# Altium project Electronics.PrjPcb
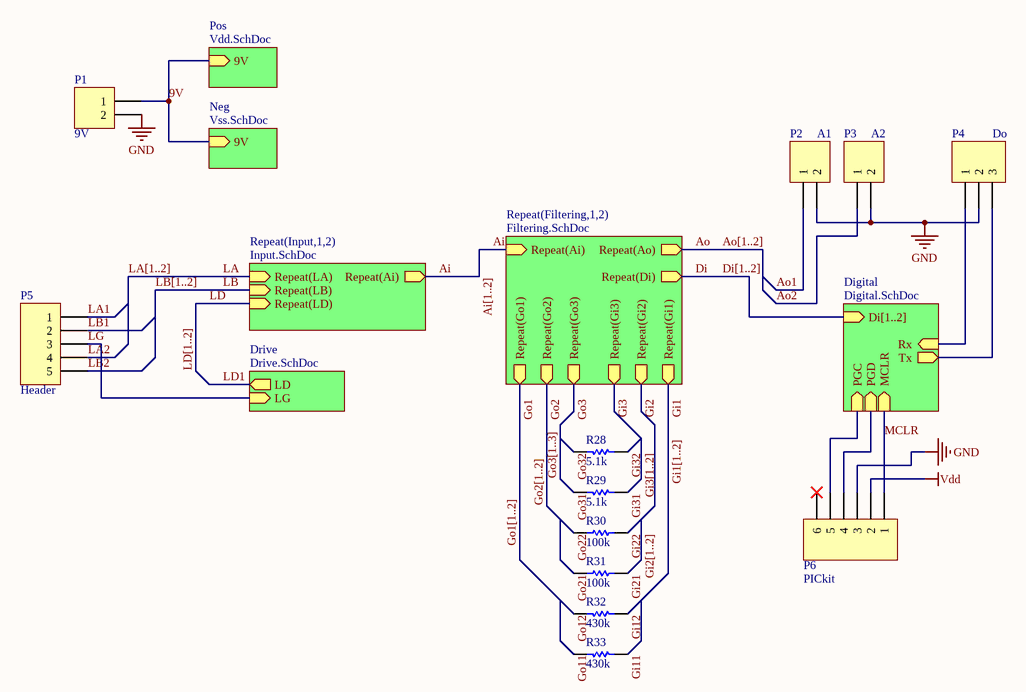
[diagram p0: Main.SchDoc]
7 sheets, 114 parts. Net scope: hierarchical (ports join the sheet entries above them; power ports are global).
Board file: Main.PcbDoc
Sheets:
  Main.SchDoc
    Filtering1 = Filtering.SchDoc
    Filtering2 = Filtering.SchDoc
    Digital = Digital.SchDoc
    Input1 = Input.SchDoc
    Input2 = Input.SchDoc
    Drive = Drive.SchDoc
    Pos = Vdd.SchDoc
    Neg = Vss.SchDoc

## Sheet Main.SchDoc: Myon Deco - Subgroup Connections
size A; DrawnBy: Matias Lopez; Revision: Prototype; SheetNumber: 1; SheetTotal: 7

### Parts
P1  9V  [HDR1X2]
P2  A1  [HDR1X2]
P3  A2  [HDR1X2]
P4  Do  [HDR1X3]
P5  Header  [HDR1X5]
P6  PICkit  [HDR1X6]
R28  value 5.1k  [AXIAL-0.3]  (hidden comment: R26)
R29  value 5.1k  [AXIAL-0.3]  (hidden comment: R26)
R30  value 100k  [AXIAL-0.3]  (hidden comment: R17)
R31  value 100k  [AXIAL-0.3]  (hidden comment: R17)
R32  value 430k  [AXIAL-0.3]  (hidden comment: R14)
R33  value 430k  [AXIAL-0.3]  (hidden comment: R14)

### Sub-sheets
Digital = Digital.SchDoc: Di[1..2] (in), Rx (in), PGC (in), PGD (in), MCLR (in), Tx (out)
Drive = Drive.SchDoc: LG (in), LD (out)
Neg = Vss.SchDoc: 9V (in)
Pos = Vdd.SchDoc: 9V (in)
Repeat(Filtering,1,2) = Filtering.SchDoc: Repeat(Ai) (in), Repeat(Ao) (out), Repeat(Di) (out), Repeat(Gi1) (out), Repeat(Go1) (out), Repeat(Gi3) (out), Repeat(Go3) (out), Repeat(Go2) (out), Repeat(Gi2) (out)
Repeat(Input,1,2) = Input.SchDoc: Repeat(Ai) (out), Repeat(LA) (in), Repeat(LB) (in), Repeat(LD) (in)

### Nets
GND: P1.2 P2.2 P3.2 P4.2 P6.3
Vdd: P6.2
9V: P1.1 ; sheet Pos/9V, sheet Neg/9V
Ai: sheet Repeat(Filtering,1,2)/Repeat(Ai), sheet Repeat(Input,1,2)/Repeat(Ai)
Ao: sheet Repeat(Filtering,1,2)/Repeat(Ao)
Ao1: P2.1 R31.1  [also labelled Gi21]
Ao2: P3.1 R30.1  [also labelled Gi22]
Di: sheet Repeat(Filtering,1,2)/Repeat(Di)
Di1: R29.1  [also labelled Gi31]
Di2: R28.1  [also labelled Gi32]
Gi1: sheet Repeat(Filtering,1,2)/Repeat(Gi1)
Gi2: sheet Repeat(Filtering,1,2)/Repeat(Gi2)
Gi3: sheet Repeat(Filtering,1,2)/Repeat(Gi3)
Gi11: R33.2  [project net GHPF]
Gi12: R32.2  [project net GHPF]
Go1: sheet Repeat(Filtering,1,2)/Repeat(Go1)
Go2: sheet Repeat(Filtering,1,2)/Repeat(Go2)
Go3: sheet Repeat(Filtering,1,2)/Repeat(Go3)
Go11: R33.1
Go12: R32.1
Go21: R31.2
Go22: R30.2
Go31: R29.2
Go32: R28.2
LA: sheet Repeat(Input,1,2)/Repeat(LA)
LA1: P5.1
LA2: P5.4
LB: sheet Repeat(Input,1,2)/Repeat(LB)
LB1: P5.2
LB2: P5.5
LD: sheet Repeat(Input,1,2)/Repeat(LD)
LG: P5.3 ; sheet Drive/LG
MCLR: P6.1 ; sheet Digital/MCLR
NetP4_1: P4.1 ; sheet Digital/Rx
NetP4_3: P4.3 ; sheet Digital/Tx
NetP6_4: P6.4 ; sheet Digital/PGD
NetP6_5: P6.5 ; sheet Digital/PGC

Not connected (* = marked no-connect by the designer): P6 6*

### Buses and harness runs
bus Ai[1..2]
bus Ao[1..2]
bus Di[1..2] = sheet Digital/Di[1..2]
bus Gi1[1..2]
bus Gi2[1..2]
bus Gi3[1..2]
bus Go1[1..2]
bus Go2[1..2]
bus Go3[1..3]
bus LA[1..2]
bus LB[1..2]
bus LD[1..2]

### Library data of the parts
P1-P3 = Header 2: Header, 2-Pin; LatestRevisionDate: 17-Jul-2002; LatestRevisionNote: Re-released for DXP Platform.; Publisher: Altium Limited
P4 = Header 3: Header, 3-Pin; LatestRevisionDate: 17-Jul-2002; LatestRevisionNote: Re-released for DXP Platform.; Publisher: Altium Limited
P5 = Header 5: Header, 5-Pin; LatestRevisionDate: 17-Jul-2002; LatestRevisionNote: Re-released for DXP Platform.; Publisher: Altium Limited
P6 = Header 6: Header, 6-Pin; LatestRevisionDate: 17-Jul-2002; LatestRevisionNote: Re-released for DXP Platform.; Publisher: Altium Limited
R28-R33 = Res1: Resistor; Published: 8-Jun-2000; LatestRevisionDate: 17-Jul-2002; LatestRevisionNote: Re-released for DXP Platform.; PackageReference: AXIAL-0.3; Publisher: Altium Limited; PackageDescription: Axial Device, Thru-Hole; 2 Leads; 0.3 in Pin Spacing

## Sheet Filtering.SchDoc: Myon Deco - Filtering Stages
size A; DrawnBy: Matias Lopez; Revision: Prototype; SheetNumber: 5; SheetTotal: 6
Used 2 times, as channels Filtering1, Filtering2. Parts and nets are listed once, with the designators drawn on the sheet.
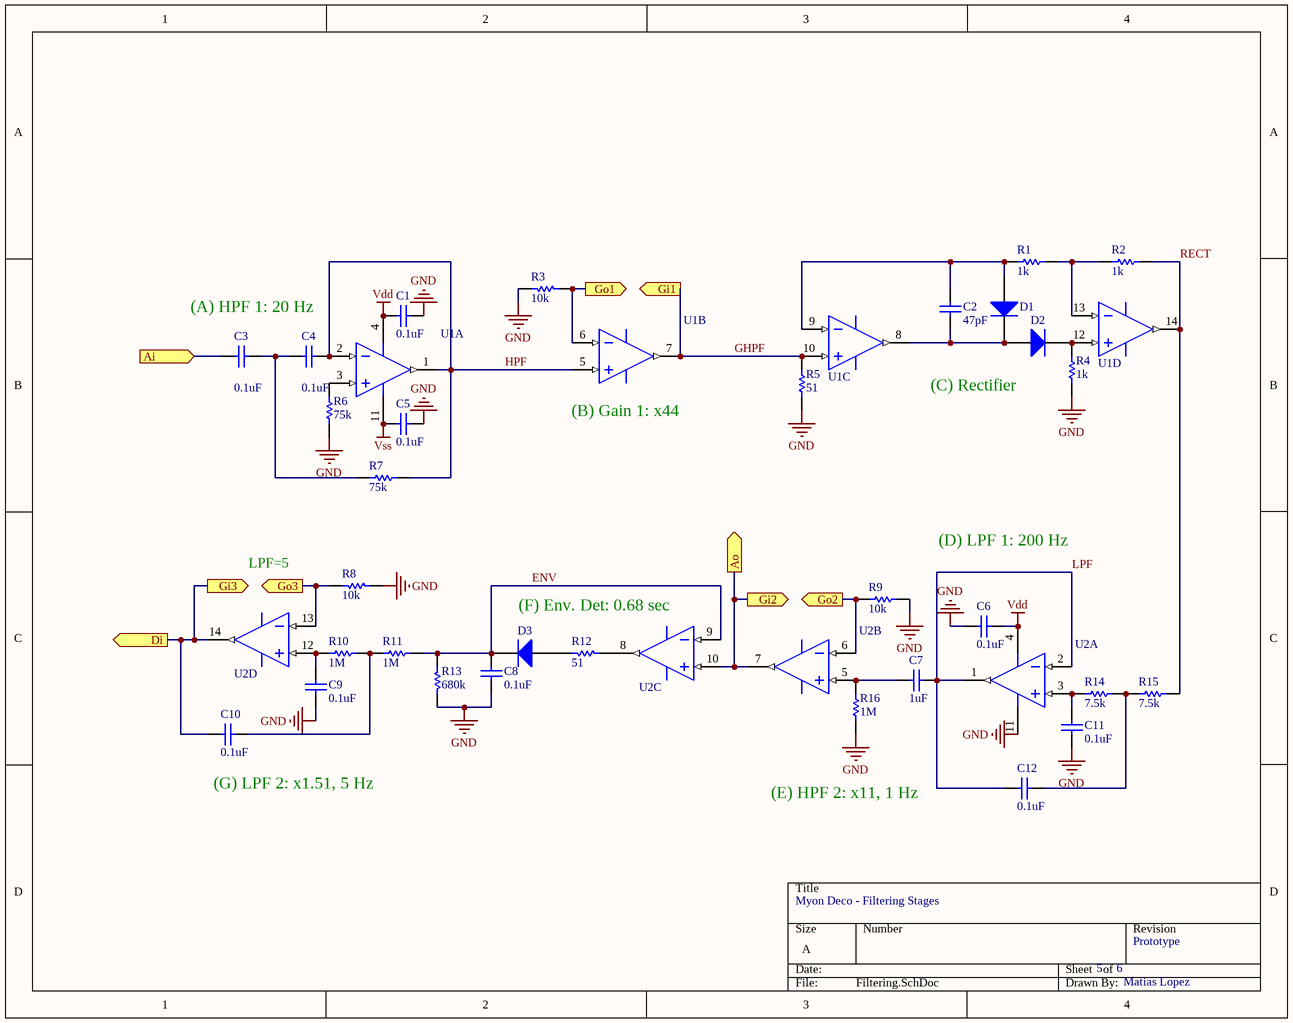
[diagram p1: Filtering.SchDoc]

### Parts
C1  value 0.1uF  [C0805]  (hidden comment: Cap)
C2  value 47pF  [C0805]  (hidden comment: C20)
C3  value 0.1uF  [C0805]  (hidden comment: C15)
C4  value 0.1uF  [C0805]  (hidden comment: C16)
C5  value 0.1uF  [C0805]  (hidden comment: Cap)
C6  value 0.1uF  [C0805]  (hidden comment: Cap)
C7  value 1uF  [C0805]  (hidden comment: C19)
C8  value 0.1uF  [C0805]  (hidden comment: C23)
C9  value 0.1uF  [C0805]  (hidden comment: C21)
C10  value 0.1uF  [C0805]  (hidden comment: C22)
C11  value 0.1uF  [C0805]  (hidden comment: C21)
C12  value 0.1uF  [C0805]  (hidden comment: C22)
D1  D2  [425]  (value not drawn)
D2  D3  [425]  (value not drawn)
D3  D4  [425]  (value not drawn)
R1  value 1k  [C1206]  (hidden comment: R20)
R2  value 1k  [C1206]  (hidden comment: R19)
R3  value 10k  [C1206]  (hidden comment: R13)
R4  value 1k  [C1206]  (hidden comment: R24)
R5  value 51  [C1206]  (hidden comment: R25)
R6  value 75k  [C1206]  (hidden comment: R15)
R7  value 75k  [C1206]  (hidden comment: R16)
R8  value 10k  [C1206]  (hidden comment: R26)
R9  value 10k  [C1206]  (hidden comment: R18)
R10  value 1M  [C1206]  (hidden comment: R21)
R11  value 1M  [C1206]  (hidden comment: R22)
R12  value 51  [C1206]  (hidden comment: R26)
R13  value 680k  [C1206]  (hidden comment: R27)
R14  value 7.5k  [C1206]  (hidden comment: R21)
R15  value 7.5k  [C1206]  (hidden comment: R22)
R16  value 1M  [C1206]  (hidden comment: R23)
U1  U7  [TI-D14_N]  (value not drawn)  (parts A,B,C,D of 4)
U2  U8  [TI-D14_N]  (value not drawn)  (parts A,B,C,D of 4)

### Ports
Ai (in), Ao (out), Di (out), Gi1 (out), Gi2 (out), Gi3 (out), Go1 (out), Go2 (out), Go3 (out)

### Nets
GND: C1.2 C5.2 C6.1 C8.1 C9.1 C11.1 R3.1 R4.1 R5.1 R6.1 R8.1 R9.1 R13.1 R16.2 U2.11(V-)
Vdd: C1.1 C6.2 U1.4(V+) U2.4(V+)
Vss: C5.1 U1.11(V-)
Ai: C3.1 ; port Ai
Ao: U2.7(OUT_B) U2.10(IN_C+) ; port Ao, port Gi2
Di: C10.1 U2.14(OUT_D) ; port Di, port Gi3
ENV: C8.2 D3.2(K) R11.1 R13.2 U2.9(IN_C-)
GHPF: R5.2 U1.7(OUT_B) U1.10(IN_C+) ; port Gi1
Go1: R3.2 U1.6(IN_B-) ; port Go1
Go2: R9.2 U2.6(IN_B-) ; port Go2
Go3: R8.2 U2.13(IN_D-) ; port Go3
HPF: C4.2 R7.1 U1.1(OUT_A) U1.2(IN_A-) U1.5(IN_B+)
LPF: C7.2 C12.1 U2.1(OUT_A) U2.2(IN_A-)
RECT: R2.1 R15.1 U1.14(OUT_D)
NetC2_1: C2.1 D1.1(A) R1.2 U1.9(IN_C-)
NetC2_2: C2.2 D1.2(K) D2.1(A) U1.8(OUT_C)
NetC3_2: C3.2 C4.1 R7.2
NetC7_1: C7.1 R16.1 U2.5(IN_B+)
NetC9_2: C9.2 R10.2 U2.12(IN_D+)
NetC10_2: C10.2 R10.1 R11.2
NetC11_2: C11.2 R14.2 U2.3(IN_A+)
NetC12_2: C12.2 R14.1 R15.2
NetD2_2: D2.2(K) R4.2 U1.12(IN_D+)
NetD3_1: D3.1(A) R12.1
NetR1_1: R1.1 R2.2 U1.13(IN_D-)
NetR6_2: R6.2 U1.3(IN_A+)
NetR12_2: R12.2 U2.8(OUT_C)

### Channels
Filtering1: designators end in _Filtering1; ports Ai=Ai1 Ao=Ao1 Di=Di1 Gi1=GHPF Gi2=Ao1 Gi3=Di1 Go1=Go11 Go2=Go21 Go3=Go31
Filtering2: designators end in _Filtering2; ports Ai=Ai2 Ao=Ao2 Di=Di2 Gi1=GHPF Gi2=Ao2 Gi3=Di2 Go1=Go12 Go2=Go22 Go3=Go32

### Notes on the sheet
- (A) HPF 1: 20 Hz
- (near U1) (B) Gain 1: x44
- (C) Rectifier
- LPF=5
- (D) LPF 1: 200 Hz
- (F) Env. Det: 0.68 sec
- (near C10) (G) LPF 2: x1.51, 5 Hz
- (E) HPF 2: x11, 1 Hz

### Library data of the parts
C1-C12 = Cap: Capacitor; Published: 8-Jun-2000; LatestRevisionDate: 17-Jul-2002; LatestRevisionNote: Re-released for DXP Platform.; PackageReference: RAD-0.3; Publisher: Altium Limited; PackageDescription: Radial Cap, Thru-Hole; 2 Leads; 0.3 in Pin Spacing
D1-D3 = Diode 1N4148: High Conductance Fast Diode; Published: 8-Jun-2000; LatestRevisionDate: 17-Jul-2002; LatestRevisionNote: Re-released for DXP Platform.; DatasheetVersion: 1997; PackageReference: DO-35; Publisher: Altium Limited; PackageDescription: Diode, Axial; Body 3.8 x 1.9 mm (LxDia. max), Lead Dia. 0.53 mm (max); Code_JEDEC: DO-204-AH; ComponentLink1Description: Manufacturer Link; ComponentLink1URL: http://www.fairchildsemi.com/; ComponentLink2Description: Datasheet; ComponentLink2URL: http://www.fairchildsemi.com/ds/1N%2F1N4148.pdf
R1-R16 = Res1: Resistor; Published: 8-Jun-2000; LatestRevisionDate: 17-Jul-2002; LatestRevisionNote: Re-released for DXP Platform.; PackageReference: AXIAL-0.3; Publisher: Altium Limited; PackageDescription: Axial Device, Thru-Hole; 2 Leads; 0.3 in Pin Spacing
U1 U2 = OPA4180IDR: 0.1 uV/C Drift, Quad, Low Noise, Rail-to-Rail, Zero Drift Operational Amplifier, 4 to 36 V, -40 to 105 degC, 14-pin SOIC (D14), Green (RoHS & no Sb/Br); Manufacturer: Texas Instruments; CMRR(Min)(dB): 104; GBW(Typ)(MHz): 2; IIB(Max)(pA): 1700; Iq per channel(Max)(mA): 0.525; Number of Channels: 4; Offset Drift(Typ)(uV/C): 0.1; Rating: Catalog; Slew Rate(Typ)(V/us): 0.8; Sub Family: Precision Amplifier; Total Supply Voltage(Max)(+5V is 5, +/-5V is 10): 36; Vio (25C)(Max)(mV): 0.075; DatasheetVersion: SBOS584C; PackageVersion: 4040047-5/M, 06/2011; PackageReference: D14; PackageDescription: 14-Pin Plastic Small Outline, Body 8.65 x 3.9 mm, Pitch 1.27 mm; Eco-Plan: Green (RoHS & no Sb/Br); Total Supply Voltage(Min)(+5V is 5, +/-5V is 10): 4; Mounting Technology: Surface Mount; Code_JEDEC: MS-012; PartNumber: OPA4180IDR; ComponentLink1Description: Manufacturer URL; ComponentLink1URL: http://www.ti.com/; ComponentLink2Description: Datasheet; ComponentLink2URL: http://www.ti.com/lit/ds/symlink/opa4180.pdf; ComponentLink3Description: Package Specification; ComponentLink3URL: http://www.ti.com/lit/ml/mpds177g/mpds177g.pdf

## Sheet Digital.SchDoc: Myon Deco - Digital Stage
size A; DrawnBy: Matias Lopez; Revision: Prototype; SheetNumber: 4; SheetTotal: 7
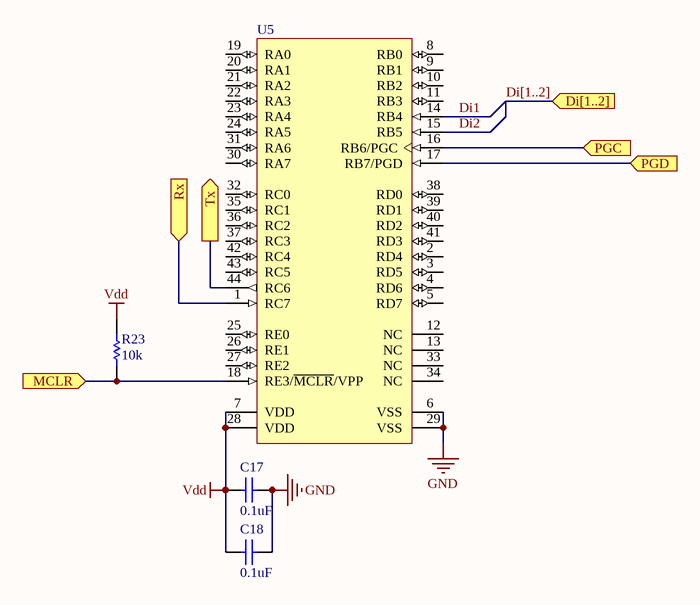
[diagram p2: Digital.SchDoc]

### Parts
C17  value 0.1uF  [C0805]  (hidden comment: Cap)
C18  value 0.1uF  [C0805]  (hidden comment: Cap)
R23  value 10k  [C1206]  (hidden comment: Res1)
U5  MYON  [MCHP-TQFP-PT44_N]  (value not drawn)

### Ports
Di[1..2] (in), MCLR (in), PGC (in), PGD (in), Rx (in), Tx (out)

### Nets
GND: C17.1 C18.1 U5.6(VSS) U5.29(VSS)
Vdd: C17.2 C18.2 R23.1 U5.7(VDD) U5.28(VDD)
Di1: U5.14(RB4)
Di2: U5.15(RB5)
MCLR: R23.2 U5.18(RE3/~{MCLR}/VPP) ; port MCLR
NetP4_1: U5.1(RC7) ; port Rx
NetP4_3: U5.44(RC6) ; port Tx
NetP6_4: U5.17(RB7/PGD) ; port PGD
NetP6_5: U5.16(RB6/PGC) ; port PGC

Not connected (* = marked no-connect by the designer): U5 2(RD4) 3(RD5) 4(RD6) 5(RD7) 8(RB0) 9(RB1) 10(RB2) 11(RB3) 12(NC) 13(NC) 19(RA0) 20(RA1) 21(RA2) 22(RA3) 23(RA4) 24(RA5) 25(RE0) 26(RE1) 27(RE2) 30(RA7) 31(RA6) 32(RC0) 33(NC) 34(NC) 35(RC1) 36(RC2) 37(RC3) 38(RD0) 39(RD1) 40(RD2) 41(RD3) 42(RC4) 43(RC5)

### Buses and harness runs
bus Di[1..2] = port Di[1..2]

### Library data of the parts
C17 C18 = Cap: Capacitor; Published: 8-Jun-2000; LatestRevisionDate: 17-Jul-2002; LatestRevisionNote: Re-released for DXP Platform.; PackageReference: RAD-0.3; Publisher: Altium Limited; PackageDescription: Radial Cap, Thru-Hole; 2 Leads; 0.3 in Pin Spacing
R23 = Res1: Resistor; Published: 8-Jun-2000; LatestRevisionDate: 17-Jul-2002; LatestRevisionNote: Re-released for DXP Platform.; PackageReference: AXIAL-0.3; Publisher: Altium Limited; PackageDescription: Axial Device, Thru-Hole; 2 Leads; 0.3 in Pin Spacing
U5 = PIC18F46K22-I/PT: Low-Power, High-Performance Microcontroller with XLP Technology, 64 MHz, 35 I/O, -40 to 85 degC, 44-pin TQFP (PT44), Tray; Manufacturer: Microchip; # of A/D Channels: 28; Digital Communication: 2 -A/E/USART, 2 -MSSP(SPI/I2C); EEPROM Data Memory (bytes): 1024; I/O Pins: 35; Internal Oscillator: 16 MHz, 31 kHz; Max. CPU Speed MHz: 64; Memory Type: Flash; Operation Voltage Range: 2.3V - 5.5V; Program Memory KWords: 32; RAM: 3896; Timers: 3 - 8-bit, 4 - 16-bit; DatasheetVersion: Rev. F; PackageVersion: C04-076B, 12/2012; PackageReference: TQFP-PT44; PackageDescription: 44-Lead Plastic Thin Quad Flatpack, 10 x 10 mm Body, 0.8 mm Pitch; Supplier 1: Digi-Key; Supplier Part Number 1: PIC18F46K22-I/PT-ND; Supplier 2: Farnell; Supplier Part Number 2: 1814980; Supplier 3: Farnell; Supplier Part Number 3: 1814980MPKG; Supplier 4: Newark; Supplier Part Number 4: 65R6013; Supplier 5: Mouser; Supplier Part Number 5: 579-PIC18F46K22IPT; Packing: TRAY; Program Memory KBytes: 64; RoHS: TRUE; Mounting Technology: Surface Mount; PartNumber: PIC18F46K22-I/PT; ComponentLink1Description: Datasheet; ComponentLink1URL: http://ww1.microchip.com/downloads/en/DeviceDoc/41412F.pdf; ComponentLink2Description: Package Specification; ComponentLink2URL: http://www.microchip.com/stellent/groups/techpub_sg/documents/packagingspec/en012702.pdf; ComponentLink3Description: URL Link1; ComponentLink3URL: Product URL:http://www.microchip.com/datasheet/PIC18F46K22

## Sheet Input.SchDoc: Myon Deco - Input Stage
size A; DrawnBy: Matias Lopez; Revision: Prototype; SheetNumber: 2; SheetTotal: 7
Used 2 times, as channels Input1, Input2. Parts and nets are listed once, with the designators drawn on the sheet.
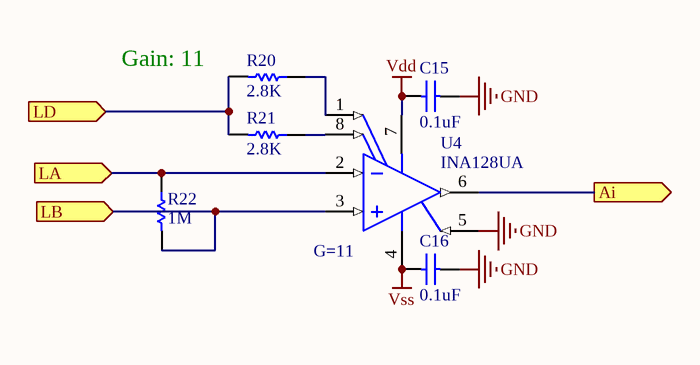
[diagram p3: Input.SchDoc]

### Parts
C15  value 0.1uF  [C0805]  (hidden comment: Cap)
C16  value 0.1uF  [C0805]  (hidden comment: Cap)
R20  value 2.8K  [C1206]  (hidden comment: Res1)
R21  value 2.8K  [C1206]  (hidden comment: Res1)
R22  value 1M  [C1206]  (hidden comment: Res1)
U4  INA128UA  [TI-D8_N]

### Ports
Ai (out), LA (in), LB (in), LD (in)

### Nets
GND: C15.1 C16.1 U4.5(REF)
Vdd: C15.2 U4.7(V+)
Vss: C16.2 U4.4(V-)
Ai: U4.6(VO) ; port Ai
LA: R22.1 U4.2(VIN-) ; port LA
LB: R22.2 U4.3(VIN+) ; port LB
LD: R20.2 R21.2 ; port LD
NetR20_1: R20.1 U4.1(RG)
NetR21_1: R21.1 U4.8(RG)

### Channels
Input1: designators end in _Input1; ports Ai=Ai1 LA=LA1 LB=LB1 LD=LD1
Input2: designators end in _Input2; ports Ai=Ai2 LA=LA2 LB=LB2 LD=LD2

### Notes on the sheet
- (near R20) Gain: 11
- (near U4) G=11

### Library data of the parts
C15 C16 = Cap: Capacitor; Published: 8-Jun-2000; LatestRevisionDate: 17-Jul-2002; LatestRevisionNote: Re-released for DXP Platform.; PackageReference: RAD-0.3; Publisher: Altium Limited; PackageDescription: Radial Cap, Thru-Hole; 2 Leads; 0.3 in Pin Spacing
R20-R22 = Res1: Resistor; Published: 8-Jun-2000; LatestRevisionDate: 17-Jul-2002; LatestRevisionNote: Re-released for DXP Platform.; PackageReference: AXIAL-0.3; Publisher: Altium Limited; PackageDescription: Axial Device, Thru-Hole; 2 Leads; 0.3 in Pin Spacing
U4 = INA128UA: Precision, Low Power Instrumentation Amplifier, -40 to 85 degC, 8-pin SOIC (D8), Green (RoHS & no Sb/Br); Manufacturer: Texas Instruments; CMRR(Min)(dB): 110; Gain(V/V): 1 to 10000; Input Bias Current (+/-)(Max)(nA): 10; Input Offset (+/-)(Max)(uV): 125; Input Offset Drift (+/-)(Max)(uV/Degrees Celsius): 1; Noise at 1kHz(Typ)(nV/rt(Hz)): 8; Non-Linearity (+/-)(Max)(%): 0.004; Quiescent Current (+/-)(Typ)(mA): 0.7; SubFamily: Dual Supply; Vs(Max)(V): 36; Vs(Min)(V): 4.5; DatasheetVersion: SBOS051B; PackageVersion: 4040047-3/M, 06/2011; PackageReference: D8; PackageDescription: 8-Pin Plastic Small Outline, Body 4.9 x 3.9 mm, Pitch 1.27 mm; Supplier 1: Digi-Key; Supplier Part Number 1: INA128UA-ND; Supplier 2: Newark; Supplier Part Number 2: 35C1730; Supplier 3: Mouser; Supplier Part Number 3: 595-INA128UA; Eco-Plan: Green (RoHS & no Sb/Br); Number of Channels: 1; Mounting Technology: Surface Mount; Code_JEDEC: MS-012; PartNumber: INA128UA; ComponentLink1Description: Manufacturer URL; ComponentLink1URL: http://www.ti.com/; ComponentLink2Description: Datasheet; ComponentLink2URL: http://www.ti.com/general/docs/lit/getliterature.tsp?genericPartNumber=INA128&fileType=pdf; ComponentLink3Description: Package Specification; ComponentLink3URL: http://www.ti.com/litv/pdf/msoi002j

## Sheet Drive.SchDoc: Myon Deco - Leg Drive
size A; DrawnBy: Matias Lopez; Revision: Prototype; SheetNumber: 3; SheetTotal: 7
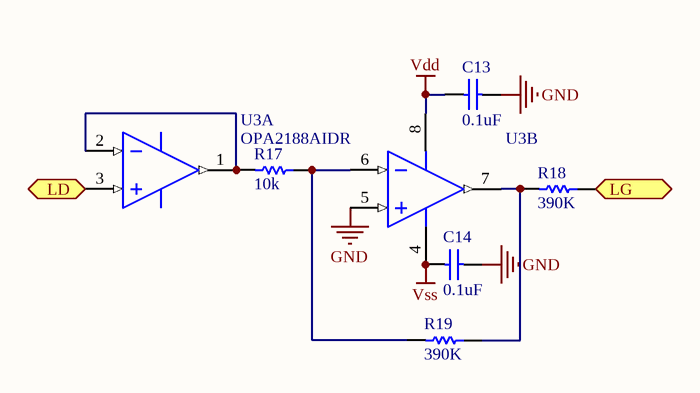
[diagram p4: Drive.SchDoc]

### Parts
C13  value 0.1uF  [C0805]  (hidden comment: Cap)
C14  value 0.1uF  [C0805]  (hidden comment: Cap)
R17  value 10k  [C1206]  (hidden comment: Res1)
R18  value 390K  [C1206]  (hidden comment: Res1)
R19  value 390K  [C1206]  (hidden comment: Res1)
U3  OPA2188AIDR  [TI-D8_N]  (parts A,B of 2)

### Ports
LD (out), LG (in)

### Nets
GND: C13.1 C14.1 U3.5(IN_B+)
Vdd: C13.2 U3.8(V+)
Vss: C14.2 U3.4(V-)
LD1: U3.3(IN_A+) ; port LD
LG: R18.1 ; port LG
NetR17_1: R17.1 R19.2 U3.6(IN_B-)
NetR17_2: R17.2 U3.1(OUT_A) U3.2(IN_A-)
NetR18_2: R18.2 R19.1 U3.7(OUT_B)

### Library data of the parts
C13 C14 = Cap: Capacitor; Published: 8-Jun-2000; LatestRevisionDate: 17-Jul-2002; LatestRevisionNote: Re-released for DXP Platform.; PackageReference: RAD-0.3; Publisher: Altium Limited; PackageDescription: Radial Cap, Thru-Hole; 2 Leads; 0.3 in Pin Spacing
R17-R19 = Res1: Resistor; Published: 8-Jun-2000; LatestRevisionDate: 17-Jul-2002; LatestRevisionNote: Re-released for DXP Platform.; PackageReference: AXIAL-0.3; Publisher: Altium Limited; PackageDescription: Axial Device, Thru-Hole; 2 Leads; 0.3 in Pin Spacing
U3 = OPA2188AIDR: 0.03 uV/degC, 6 uV Vos, Low Noise, Rail-to-Rail Output, Zero-Drift Operational Amplifier, 4 to 36 V, -40 to 105 degC, 8-pin SOIC (D8), Green (RoHS & no Sb/Br); Manufacturer: Texas Instruments; CMRR(Min)(dB): 120; GBW(Typ)(MHz): 2; IIB(Max)(pA): 850; Iq per channel(Max)(mA): 0.475; Offset Drift(Typ)(uV/C): 0.03; Packing: LARGE T&R; Rating: Catalog; Slew Rate(Typ)(V/us): 0.8; Sub Family: High Supply Voltage Amplifier (>=30V), Low Noise Amp (<=10nV/rtHz), Low Offset Voltage Amplifier (<=500uV), Low Power Amp (<=500uA), Precision Amplifier, Zero Drift Precision Amplifier; Total Supply Voltage(Max)(+5V is 5, +/-5V is 10): 36; Total Supply Voltage(Min)(+5V is 5, +/-5V is 10): 4; Vio (25C)(Max)(mV): 0.025; DatasheetVersion: SBOS525B; PackageVersion: 4040047-3/M, 06/2011; PackageReference: D8; PackageDescription: 8-Pin Plastic Small Outline, Body 4.9 x 3.9 mm, Pitch 1.27 mm; Supplier 1: Digi-Key; Supplier Part Number 1: 296-29454-2-ND; Supplier 2: Digi-Key; Supplier Part Number 2: 296-29454-1-ND; Supplier 3: Digi-Key; Supplier Part Number 3: 296-29454-6-ND; Supplier 4: Newark; Supplier Part Number 4: 61T5956; Supplier 5: Mouser; Supplier Part Number 5: 595-OPA2188AIDR; Eco-Plan: Green (RoHS & no Sb/Br); Number of Channels: 2; Mounting Technology: Surface Mount; Code_JEDEC: MS-012; PartNumber: OPA2188AIDR; ComponentLink1Description: Manufacturer URL; ComponentLink1URL: http://www.ti.com/; ComponentLink2Description: Datasheet; ComponentLink2URL: http://www.ti.com/lit/ds/symlink/opa2188.pdf; ComponentLink3Description: Package Specification; ComponentLink3URL: http://www.ti.com/litv/pdf/msoi002j

## Sheet Vdd.SchDoc: Myon Deco - Positive Supply
size A; DrawnBy: Matias Lopez; Revision: Prototype; SheetNumber: 7; SheetTotal: 7
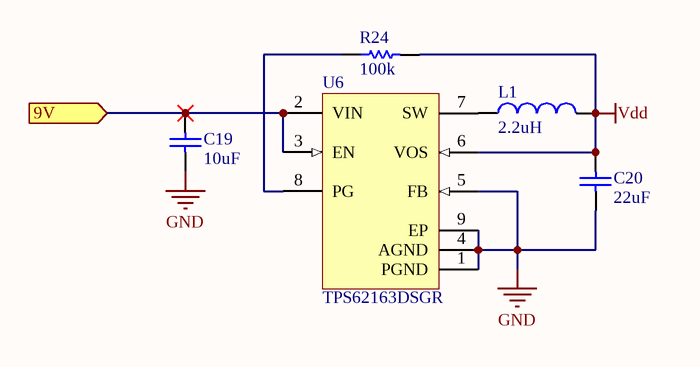
[diagram p5: Vdd.SchDoc]

### Parts
C19  value 10uF  [C1206]  (hidden comment: Cap)
C20  value 22uF  [C1206]  (hidden comment: Cap)
L1  value 2.2uH  [INDC1608L]  (hidden comment: Inductor)
R24  value 100k  [C1206]  (hidden comment: Res1)
U6  TPS62163DSGR  [DSG8-1600X900TP]

### Ports
9V (in)

### Nets
GND: C19.1 C20.1 U6.1(PGND) U6.4(AGND) U6.5(FB) U6.9(EP)
Vdd: C20.2 L1.2 R24.2 U6.6(VOS)
9V: C19.2 U6.2(VIN) U6.3(EN) ; port 9V
NetL1_1: L1.1 U6.7(SW)
NetR24_1: R24.1 U6.8(PG)

### Library data of the parts
C19 C20 = Cap: Capacitor; Published: 8-Jun-2000; LatestRevisionDate: 17-Jul-2002; LatestRevisionNote: Re-released for DXP Platform.; PackageReference: RAD-0.3; Publisher: Altium Limited; PackageDescription: Radial Cap, Thru-Hole; 2 Leads; 0.3 in Pin Spacing
L1 = Inductor: Code_IEC: 1005; Published: 8-Jun-2000; LatestRevisionDate: 29-May-2009; LatestRevisionNote: IPC-7351 Footprint Added.; PackageReference: 0402-A; Publisher: Altium Limited; PackageDescription: Chip Inductor; Code_JEITA: 0402
R24 = Res1: Resistor; Published: 8-Jun-2000; LatestRevisionDate: 17-Jul-2002; LatestRevisionNote: Re-released for DXP Platform.; PackageReference: AXIAL-0.3; Publisher: Altium Limited; PackageDescription: Axial Device, Thru-Hole; 2 Leads; 0.3 in Pin Spacing
U6 = TPS62163DSGR: Buck Step Down Regulator with 3 to 17 V Input and 5 V Output, -40 to 85 degC, 8-Pin WSON (DSG), Green (RoHS & no Sb/Br); Manufacturer: Texas Instruments; Duty Cycle(Max)(%): 100; Iout(Max)(A): 1; Iq(Typ)(mA): 0.017; Preset Vout(V): 5; Rating: Catalog; SubFamily: Step-Down Regulator; Switch Current Limit(Typ)(A): 1.8; Synchronous Rectification: TRUE; Vin(Max)(V): 17; Vin(Min)(V): 3; DatasheetVersion: SLVSAM2A; PackageVersion: revB, Oct-2010; PackageReference: DSG8-1600X900TP; PackageDescription: 8-Pin Plastic Small Outline No-Lead, 2 x 2 x 0.8 mm Body, 0.5 mm Pitch, Exposed Pad; Supplier 1: Digi-Key; Supplier Part Number 1: 296-29898-2-ND; Supplier 2: Digi-Key; Supplier Part Number 2: 296-29898-1-ND; Supplier 3: Digi-Key; Supplier Part Number 3: 296-29898-6-ND; Supplier 4: Newark; Supplier Part Number 4: 74T5559; Supplier 5: Mouser; Supplier Part Number 5: 595-TPS62163DSGR; Eco-Plan: Green (RoHS & no Sb/Br); Regulated Outputs(#): 1; Topology: Buck; Vout(Max)(V): 5; Vout(Min)(V): 5; Mounting Technology: Surface Mount; Code_JEDEC: MO-229; PartNumber: TPS62163DSGR; ComponentLink1Description: Datasheet; ComponentLink1URL: http://www.ti.com/general/docs/lit/getliterature.tsp?genericPartNumber=TPS62163&fileType=pdf; ComponentLink2Description: Package Specification; ComponentLink2URL: http://www.ti.com/litv/pdf/mpds308a; ComponentLink3Description: URL Link1; ComponentLink3URL: Samples URL:http://www.ti.com/product/tps62163#samples

## Sheet Vss.SchDoc: Myon Deco - Negative Supply
size A; DrawnBy: Matias Lopez; Revision: Prototype; SheetNumber: 6; SheetTotal: 7
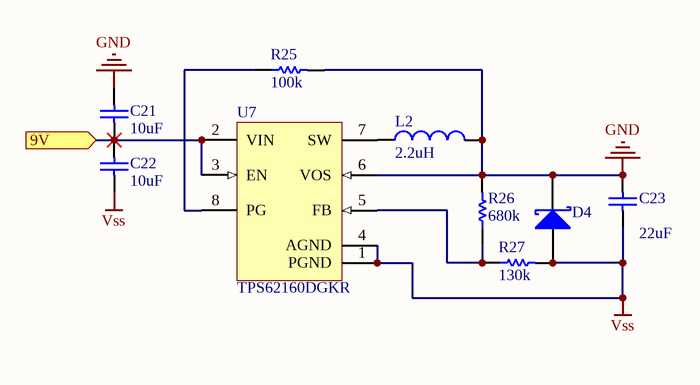
[diagram p6: Vss.SchDoc]

### Parts
C21  value 10uF  [C1206]  (hidden comment: Cap)
C22  value 10uF  [C1206]  (hidden comment: Cap)
C23  value 22uF  [C1206]  (hidden comment: Cap)
D4  D Schottky  [425]  (value not drawn)
L2  value 2.2uH  [INDC1608L]  (hidden comment: Inductor)
R25  value 100k  [C1206]  (hidden comment: Res1)
R26  value 680k  [C1206]  (hidden comment: Res1)
R27  value 130k  [C1206]  (hidden comment: Res1)
U7  TPS62160DGKR  [DGK8_N]

### Ports
9V (in)

### Nets
GND: C21.2 C23.2 D4.2(K) L2.2 R25.2 R26.2 U7.6(VOS)
Vss: C22.1 C23.1 D4.1(A) R27.2 U7.1(PGND) U7.4(AGND)
9V: C21.1 C22.2 U7.2(VIN) U7.3(EN) ; port 9V
NetL2_1: L2.1 U7.7(SW)
NetR25_1: R25.1 U7.8(PG)
NetR26_1: R26.1 R27.1 U7.5(FB)

### Library data of the parts
C21-C23 = Cap: Capacitor; Published: 8-Jun-2000; LatestRevisionDate: 17-Jul-2002; LatestRevisionNote: Re-released for DXP Platform.; PackageReference: RAD-0.3; Publisher: Altium Limited; PackageDescription: Radial Cap, Thru-Hole; 2 Leads; 0.3 in Pin Spacing
D4 = D Schottky: Schottky Diode; Published: 8-Jun-2000; LatestRevisionDate: 17-Jul-2002; LatestRevisionNote: Re-released for DXP Platform.; PackageReference: SMB; Publisher: Altium Limited; PackageDescription: DO-214-AA/SMB; 2 C-Bend Leads; Body 5.3 x 3.6 mm, inc. leads (LxW); Code_JEDEC: DO-214-AA
L2 = Inductor: Code_IEC: 1005; Published: 8-Jun-2000; LatestRevisionDate: 29-May-2009; LatestRevisionNote: IPC-7351 Footprint Added.; PackageReference: 0402-A; Publisher: Altium Limited; PackageDescription: Chip Inductor; Code_JEITA: 0402
R25-R27 = Res1: Resistor; Published: 8-Jun-2000; LatestRevisionDate: 17-Jul-2002; LatestRevisionNote: Re-released for DXP Platform.; PackageReference: AXIAL-0.3; Publisher: Altium Limited; PackageDescription: Axial Device, Thru-Hole; 2 Leads; 0.3 in Pin Spacing
U7 = TPS62160DGKR: Buck Step Down Regulator with 3 to 17 V Input and 0.9 to 6 V Output, -40 to 85 degC, 8-Pin VSSOP (DGK), Green (RoHS & no Sb/Br); Manufacturer: Texas Instruments; Duty Cycle(Max)(%): 100; Iout(Max)(A): 1; Iq(Typ)(mA): 0.017; Rating: Catalog; SubFamily: Step-Down Regulator; Switch Current Limit(Typ)(A): 1.8; Synchronous Rectification: TRUE; Vin(Max)(V): 17; Vin(Min)(V): 3; Vout(Max)(V): 6; Vout(Min)(V): 0.9; DatasheetVersion: SLVSAM2A; PackageVersion: revE, May-2006; PackageReference: DGK8; PackageDescription: 8-Pin Thin Small Outline Package 3 x 3 mm Body ,0.65 mm Pitch; Supplier 1: Digi-Key; Supplier Part Number 1: TPS62160DGKR-ND; Supplier 2: Newark; Supplier Part Number 2: 92T2383; Supplier 3: Mouser; Supplier Part Number 3: 595-TPS62160DGKR; Eco-Plan: Green (RoHS & no Sb/Br); Regulated Outputs(#): 1; Topology: Buck; Mounting Technology: Surface Mount; Code_JEDEC: MO-187-AA; PartNumber: TPS62160DGKR; ComponentLink1Description: Datasheet; ComponentLink1URL: http://www.ti.com/general/docs/lit/getliterature.tsp?genericPartNumber=TPS62160&fileType=pdf; ComponentLink2Description: Package Specification; ComponentLink2URL: http://www.ti.com/lit/ml/mpds028d/mpds028d.pdf; ComponentLink3Description: URL Link1; ComponentLink3URL: Samples URL:http://www.ti.com/product/tps62160#samples

## Nets that join several sheets
GND: Main (5 pins), Filtering1 (15 pins), Filtering2 (15 pins), Digital (C17.1 C18.1 U5.6 U5.29), Input1 (C15_Input1.1 C16_Input1.1 U4_Input1.5), Input2 (C15_Input2.1 C16_Input2.1 U4_Input2.5), Drive (C13.1 C14.1 U3.5), Vdd (6 pins), Vss (7 pins)
Vdd: Main (P6.2), Filtering1 (C1_Filtering1.1 C6_Filtering1.2 U1_Filtering1.4 U2_Filtering1.4), Filtering2 (C1_Filtering2.1 C6_Filtering2.2 U1_Filtering2.4 U2_Filtering2.4), Digital (5 pins), Input1 (C15_Input1.2 U4_Input1.7), Input2 (C15_Input2.2 U4_Input2.7), Drive (C13.2 U3.8), Vdd (C20.2 L1.2 R24.2 U6.6)
Vss: Filtering1 (C5_Filtering1.1 U1_Filtering1.11), Filtering2 (C5_Filtering2.1 U1_Filtering2.11), Input1 (C16_Input1.2 U4_Input1.4), Input2 (C16_Input2.2 U4_Input2.4), Drive (C14.2 U3.4), Vss (6 pins)
9V: Main (P1.1), Vdd (C19.2 U6.2 U6.3), Vss (C21.1 C22.2 U7.2 U7.3)
Ai1: Filtering1 (C3_Filtering1.1), Input1 (U4_Input1.6)
Ai2: Filtering2 (C3_Filtering2.1), Input2 (U4_Input2.6)
Ao1: Main (P2.1 R31.1), Filtering1 (U2_Filtering1.7 U2_Filtering1.10)
Ao2: Main (P3.1 R30.1), Filtering2 (U2_Filtering2.7 U2_Filtering2.10)
Di1: Main (R29.1), Filtering1 (C10_Filtering1.1 U2_Filtering1.14), Digital (U5.14)
Di2: Main (R28.1), Filtering2 (C10_Filtering2.1 U2_Filtering2.14), Digital (U5.15)
GHPF: Main (R32.2), Filtering2 (R5_Filtering2.2 U1_Filtering2.7 U1_Filtering2.10)
GHPF: Main (R33.2), Filtering1 (R5_Filtering1.2 U1_Filtering1.7 U1_Filtering1.10)
Go11: Main (R33.1), Filtering1 (R3_Filtering1.2 U1_Filtering1.6)
Go12: Main (R32.1), Filtering2 (R3_Filtering2.2 U1_Filtering2.6)
Go21: Main (R31.2), Filtering1 (R9_Filtering1.2 U2_Filtering1.6)
Go22: Main (R30.2), Filtering2 (R9_Filtering2.2 U2_Filtering2.6)
Go31: Main (R29.2), Filtering1 (R8_Filtering1.2 U2_Filtering1.13)
Go32: Main (R28.2), Filtering2 (R8_Filtering2.2 U2_Filtering2.13)
LA1: Main (P5.1), Input1 (R22_Input1.1 U4_Input1.2)
LA2: Main (P5.4), Input2 (R22_Input2.1 U4_Input2.2)
LB1: Main (P5.2), Input1 (R22_Input1.2 U4_Input1.3)
LB2: Main (P5.5), Input2 (R22_Input2.2 U4_Input2.3)
LD1: Input1 (R20_Input1.2 R21_Input1.2), Drive (U3.3)
LG: Main (P5.3), Drive (R18.1)
MCLR: Main (P6.1), Digital (R23.2 U5.18)
NetP4_1: Main (P4.1), Digital (U5.1)
NetP4_3: Main (P4.3), Digital (U5.44)
NetP6_4: Main (P6.4), Digital (U5.17)
NetP6_5: Main (P6.5), Digital (U5.16)